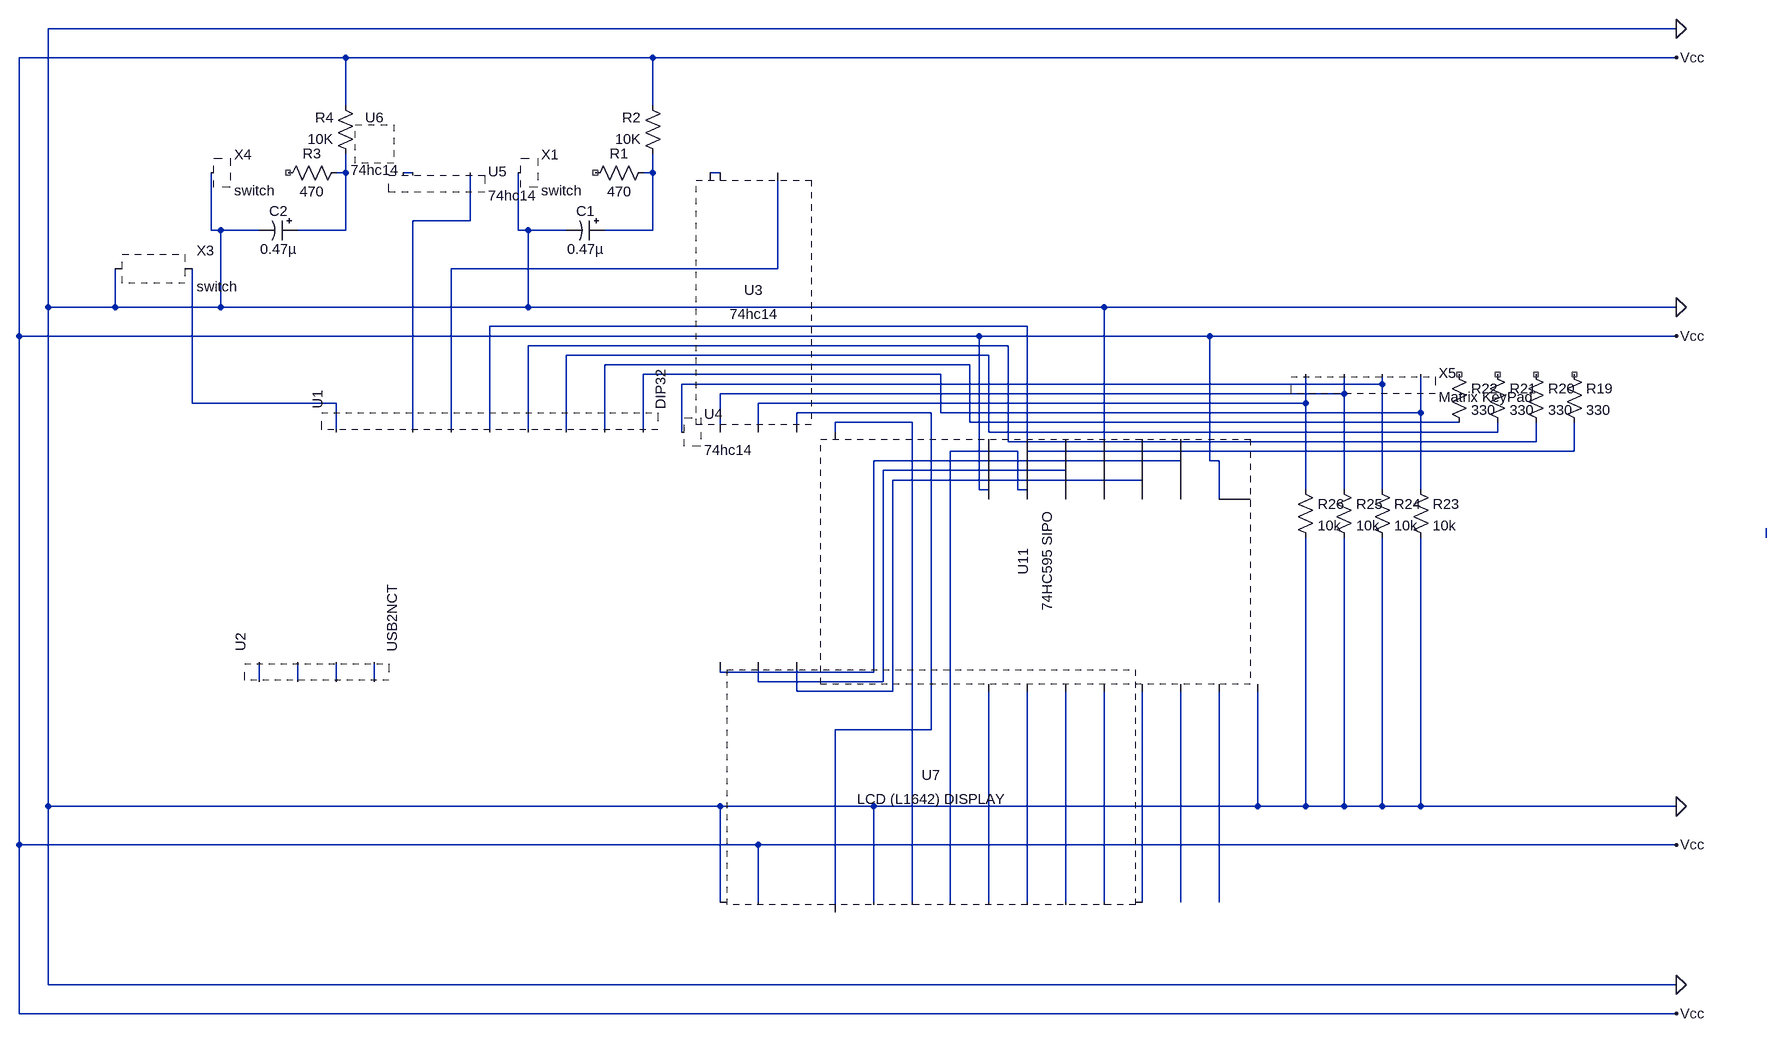
[diagram p0: schematic Lab 8 Circuit Schematic.asc]
Lab 8 Circuit Schematic.asc, the LTspice schematic file:
Version 4
SHEET 1 3364 740
WIRE 1664 -1680 -1120 -1680
WIRE -624 -1632 -1168 -1632
WIRE -112 -1632 -624 -1632
WIRE 1664 -1632 -112 -1632
WIRE -624 -1552 -624 -1632
WIRE -112 -1552 -112 -1632
WIRE -624 -1440 -624 -1472
WIRE -624 -1440 -640 -1440
WIRE -512 -1440 -528 -1440
WIRE -112 -1440 -112 -1472
WIRE -112 -1440 -128 -1440
WIRE 0 -1440 -16 -1440
WIRE -416 -1360 -416 -1440
WIRE -416 -1360 -512 -1360
WIRE -848 -1344 -848 -1440
WIRE -832 -1344 -848 -1344
WIRE -768 -1344 -832 -1344
WIRE -624 -1344 -624 -1440
WIRE -624 -1344 -704 -1344
WIRE -336 -1344 -336 -1440
WIRE -320 -1344 -336 -1344
WIRE -256 -1344 -320 -1344
WIRE -112 -1344 -112 -1440
WIRE -112 -1344 -192 -1344
WIRE 96 -1280 96 -1440
WIRE 96 -1280 -448 -1280
WIRE -1120 -1216 -1120 -1680
WIRE -1008 -1216 -1008 -1280
WIRE -1008 -1216 -1120 -1216
WIRE -832 -1216 -832 -1344
WIRE -832 -1216 -1008 -1216
WIRE -320 -1216 -320 -1344
WIRE -320 -1216 -832 -1216
WIRE 640 -1216 -320 -1216
WIRE 1664 -1216 640 -1216
WIRE 512 -1184 -384 -1184
WIRE -1168 -1168 -1168 -1632
WIRE 432 -1168 -1168 -1168
WIRE 816 -1168 432 -1168
WIRE 1664 -1168 816 -1168
WIRE 480 -1152 -320 -1152
WIRE 448 -1136 -256 -1136
WIRE 416 -1120 -192 -1120
WIRE 368 -1104 -128 -1104
WIRE 1104 -1088 1104 -1104
WIRE 1104 -1088 -64 -1088
WIRE 1040 -1072 1040 -1104
WIRE 1040 -1072 0 -1072
WIRE -880 -1056 -880 -1280
WIRE -640 -1056 -880 -1056
WIRE 976 -1056 976 -1104
WIRE 976 -1056 64 -1056
WIRE 352 -1040 128 -1040
WIRE 368 -1040 368 -1104
WIRE 1168 -1040 1168 -1104
WIRE 1168 -1040 368 -1040
WIRE 320 -1024 192 -1024
WIRE 416 -1024 416 -1120
WIRE 1232 -1024 416 -1024
WIRE -640 -1008 -640 -1056
WIRE -512 -1008 -512 -1360
WIRE -448 -1008 -448 -1280
WIRE -384 -1008 -384 -1184
WIRE -320 -1008 -320 -1152
WIRE -256 -1008 -256 -1136
WIRE -192 -1008 -192 -1120
WIRE -128 -1008 -128 -1104
WIRE -64 -1008 -64 -1088
WIRE 0 -1008 0 -1072
WIRE 64 -1008 64 -1056
WIRE 128 -1008 128 -1040
WIRE 192 -1008 192 -1024
WIRE 448 -1008 448 -1136
WIRE 1296 -1008 1296 -1024
WIRE 1296 -1008 448 -1008
WIRE 480 -992 480 -1152
WIRE 1360 -992 1360 -1024
WIRE 1360 -992 480 -992
WIRE 496 -976 384 -976
WIRE 512 -976 512 -1184
WIRE 1424 -976 1424 -1024
WIRE 1424 -976 512 -976
WIRE 768 -960 256 -960
WIRE 816 -960 816 -1168
WIRE 832 -960 816 -960
WIRE 576 -944 272 -944
WIRE 704 -928 288 -928
WIRE 432 -912 432 -1168
WIRE 448 -912 432 -912
WIRE 496 -912 496 -976
WIRE 512 -912 496 -912
WIRE 976 -912 976 -1056
WIRE 1040 -912 1040 -1072
WIRE 1104 -912 1104 -1088
WIRE 1168 -912 1168 -1040
WIRE 448 -896 448 -912
WIRE 512 -896 512 -912
WIRE 576 -896 576 -944
WIRE 640 -896 640 -1216
WIRE 704 -896 704 -928
WIRE 768 -896 768 -960
WIRE 832 -896 832 -960
WIRE 2512 -832 2512 -848
WIRE 0 -608 0 -624
WIRE 256 -608 256 -960
WIRE 256 -608 0 -608
WIRE -768 -592 -768 -624
WIRE -704 -592 -704 -624
WIRE -640 -592 -640 -624
WIRE -576 -592 -576 -624
WIRE 64 -592 64 -624
WIRE 272 -592 272 -944
WIRE 272 -592 64 -592
WIRE 128 -576 128 -624
WIRE 288 -576 288 -928
WIRE 288 -576 128 -576
WIRE 352 -512 352 -1040
WIRE 352 -512 192 -512
WIRE -1120 -384 -1120 -1216
WIRE -960 -384 -1120 -384
WIRE 0 -384 -960 -384
WIRE 256 -384 0 -384
WIRE 896 -384 896 -576
WIRE 896 -384 256 -384
WIRE 976 -384 976 -832
WIRE 976 -384 896 -384
WIRE 1040 -384 1040 -832
WIRE 1040 -384 976 -384
WIRE 1104 -384 1104 -832
WIRE 1104 -384 1040 -384
WIRE 1168 -384 1168 -832
WIRE 1168 -384 1104 -384
WIRE 1664 -384 1168 -384
WIRE -1168 -320 -1168 -1168
WIRE -960 -320 -1168 -320
WIRE 64 -320 -960 -320
WIRE 1664 -320 64 -320
WIRE 0 -224 0 -384
WIRE 64 -224 64 -320
WIRE 192 -224 192 -512
WIRE 256 -224 256 -384
WIRE 320 -224 320 -1024
WIRE 384 -224 384 -976
WIRE 448 -224 448 -576
WIRE 512 -224 512 -576
WIRE 576 -224 576 -576
WIRE 640 -224 640 -576
WIRE 704 -224 704 -576
WIRE 768 -224 768 -576
WIRE 832 -224 832 -576
WIRE 192 -208 192 -224
WIRE -1120 320 -1120 -384
WIRE 1664 320 -1120 320
WIRE -1168 368 -1168 -320
WIRE 1664 368 -1168 368
FLAG 1664 -1680 0
FLAG 1664 -1216 0
FLAG 1664 -384 0
FLAG 1664 320 0
FLAG 1664 -1632 Vcc
FLAG 1664 -1168 Vcc
FLAG 1664 -320 Vcc
FLAG 1664 368 Vcc
SYMBOL Misc\\DIP32 -464 -848 R270
SYMATTR InstName U1
SYMBOL Misc\\USB2NCT -736 -656 R270
SYMATTR InstName U2
SYMBOL switch -880 -1280 R0
SYMATTR InstName X3
SYMBOL Matrix\ KeyPad 1120 -1120 R0
SYMATTR InstName X5
SYMBOL res 1408 -1120 R0
SYMATTR InstName R19
SYMATTR Value 330
SYMBOL res 1344 -1120 R0
SYMATTR InstName R20
SYMATTR Value 330
SYMBOL res 1280 -1120 R0
SYMATTR InstName R21
SYMATTR Value 330
SYMBOL res 1216 -1120 R0
SYMATTR InstName R22
SYMATTR Value 330
SYMBOL res 1152 -928 R0
SYMATTR InstName R23
SYMATTR Value 10k
SYMBOL res 1088 -928 R0
SYMATTR InstName R24
SYMATTR Value 10k
SYMBOL res 1024 -928 R0
SYMATTR InstName R25
SYMATTR Value 10k
SYMBOL res 960 -928 R0
SYMATTR InstName R26
SYMATTR Value 10k
SYMBOL 74HC595\ SIPO 528 -720 R270
SYMATTR InstName U11
SYMBOL 74HC\\74hc14 -480 -1488 R0
SYMATTR InstName U5
SYMBOL 74HC\\74hc14 -576 -1488 R0
SYMATTR InstName U6
SYMBOL polcap -704 -1360 R90
WINDOW 3 32 32 VTop 2
WINDOW 0 0 32 VBottom 2
SYMATTR Value 0.47µ
SYMATTR InstName C2
SYMATTR Description Capacitor
SYMATTR Type cap
SYMATTR SpiceLine V=50 Irms=22m Rser=3.9 Lser=0 mfg="Nichicon" pn="UPL1HR47MAH" type="Al electrolytic"
SYMBOL res -624 -1456 R90
WINDOW 0 0 56 VBottom 2
WINDOW 3 32 56 VTop 2
SYMATTR InstName R3
SYMATTR Value 470
SYMBOL res -608 -1456 R180
WINDOW 0 36 76 Left 2
WINDOW 3 36 40 Left 2
SYMATTR InstName R4
SYMATTR Value 10K
SYMBOL switch -720 -1440 R0
SYMATTR InstName X4
SYMBOL 74HC\\74hc14 32 -1488 R0
SYMATTR InstName U3
SYMBOL 74HC\\74hc14 -64 -1488 R0
SYMATTR InstName U4
SYMBOL polcap -192 -1360 R90
WINDOW 3 32 32 VTop 2
WINDOW 0 0 32 VBottom 2
SYMATTR Value 0.47µ
SYMATTR InstName C1
SYMATTR Description Capacitor
SYMATTR Type cap
SYMATTR SpiceLine V=50 Irms=22m Rser=3.9 Lser=0 mfg="Nichicon" pn="UPL1HR47MAH" type="Al electrolytic"
SYMBOL res -112 -1456 R90
WINDOW 0 0 56 VBottom 2
WINDOW 3 32 56 VTop 2
SYMATTR InstName R1
SYMATTR Value 470
SYMBOL res -96 -1456 R180
WINDOW 0 36 76 Left 2
WINDOW 3 36 40 Left 2
SYMATTR InstName R2
SYMATTR Value 10K
SYMBOL switch -208 -1440 R0
SYMATTR InstName X1
SYMBOL LCD\ (L1642)\ DISPLAY 144 -288 R0
SYMATTR InstName U7

The netlist it stands for:
* Lab 8 Circuit Schematic.asc
* U1: DIP32 (symbol Misc\DIP32 not available, pin order unknown); nets seen at it: N005, N006, N007, N008, N009, N010, N011, N014
* U2: USB2NCT (symbol Misc\USB2NCT not available, pin order unknown); nets seen at it: N023, N024, N025, N026
* X3: switch (symbol switch not available, pin order unknown); nets seen at it: 0, N014
* X5: Matrix KeyPad (symbol Matrix KeyPad not available, pin order unknown); nets seen at it: N011, N012, N013, N015
R19 NC_01 N007 330
R20 NC_02 N008 330
R21 NC_03 N009 330
R22 NC_04 N010 330
R23 N011 0 10k
R24 N012 0 10k
R25 N013 0 10k
R26 N015 0 10k
* U11: 74HC595 SIPO (symbol 74HC595 SIPO not available, pin order unknown); nets seen at it: 0, N017, N018, N019, N020, N021, N027, N028, N029, N030, N031, N032, N033, Vcc
* U5: 74hc14 (symbol 74HC\74hc14 not available, pin order unknown); nets seen at it: N002, N005
* U6: 74hc14 (symbol 74HC\74hc14 not available, pin order unknown); nets seen at it: 
C2 N001 0 0.47µ V=50 Irms=22m Rser=3.9 Lser=0 mfg="Nichicon" pn="UPL1HR47MAH" type="Al electrolytic"
R3 N001 NC_05 470
R4 N001 Vcc 10K
* X4: switch (symbol switch not available, pin order unknown); nets seen at it: 0
* U3: 74hc14 (symbol 74HC\74hc14 not available, pin order unknown); nets seen at it: N004, N006, N013, N015, N016
* U4: 74hc14 (symbol 74HC\74hc14 not available, pin order unknown); nets seen at it: N012
C1 N003 0 0.47µ V=50 Irms=22m Rser=3.9 Lser=0 mfg="Nichicon" pn="UPL1HR47MAH" type="Al electrolytic"
R1 N003 NC_06 470
R2 N003 Vcc 10K
* X1: switch (symbol switch not available, pin order unknown); nets seen at it: 0
* U7: LCD (L1642) DISPLAY (symbol LCD (L1642) DISPLAY not available, pin order unknown); nets seen at it: 0, N016, N017, N018, N019, N020, N021, N027, N028, N029, N030, N031, Vcc
.backanno
.end